# EAGLE design diagramm (EAGLE 9.5.2)
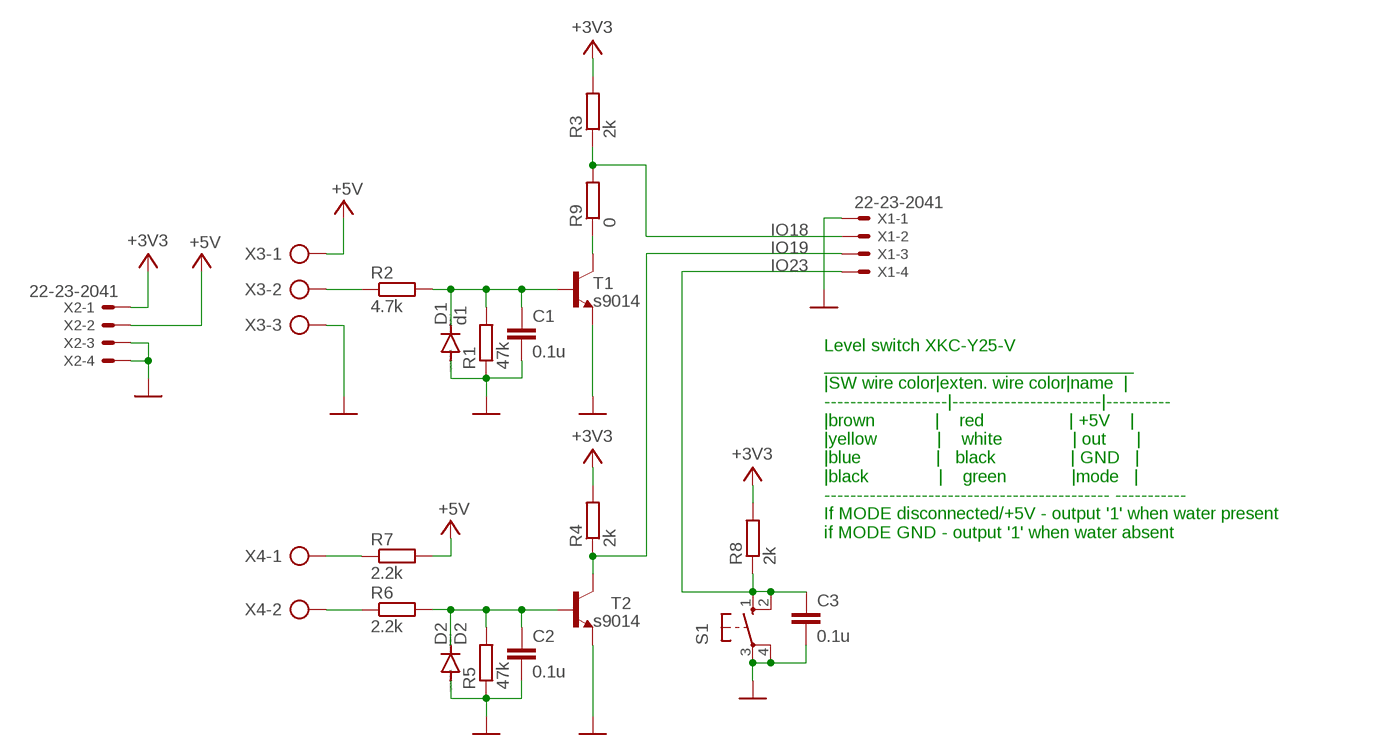
[diagram p0: schematic, sheet 1]

## Parts
C1  0.1u  C-EUC1206  [C1206]
C2  0.1u  C-EUC1206  [C1206]
C3  0.1u  C-EUC1206  [C1206]
D1  d1  DIODE-DO214AC  [DO214AC]
D2  D2  DIODE-DO214AC  [DO214AC]
R1  47k  R-EU_R1206  [R1206]
R2  4.7k  R-EU_R1206  [R1206]
R3  2k  R-EU_R1206  [R1206]
R4  2k  R-EU_R1206  [R1206]
R5  47k  R-EU_R1206  [R1206]
R6  2.2k  R-EU_R1206  [R1206]
R7  2.2k  R-EU_R1206  [R1206]
R8  2k  R-EU_R1206  [R1206]
R9  0  R-EU_R1206  [R1206]
S1  10-XX  [B3F-10XX]
T1  s9014  BC808-NPN-SOT23-BEC  [SOT23-BEC]
T2  s9014  BC808-NPN-SOT23-BEC  [SOT23-BEC]
X1  22-23-2041  [22-23-2041]
X2  22-23-2041  [22-23-2041]
X3  AK300/3  [AK300/3]
X4  AK300/2  [AK300/2]

## Nets
+3V3: R3.2 R4.2 R8.2 X2.1
+5V: R7.2 X2.2 X3.1
GND: C1.2 C2.2 C3.2 D1.A D2.A R1.1 R5.1 S1.3(P) S1.4(P1) T1.E T2.E X1.1 X2.3 X2.4 X3.3
IO18: R3.1 R9.2 X1.2
IO19: R4.1 T2.C X1.3
IO23: C3.1 R8.1 S1.1(S) S1.2(S1) X1.4
N$1: R7.1 X4.1
N$2: R2.1 X3.2
N$3: C1.1 D1.C R1.2 R2.2 T1.B
N$4: R6.1 X4.2
N$5: R9.1 T1.C
N$6: C2.1 D2.C R5.2 R6.2 T2.B

## Notes on the sheet
- Level switch XKC-Y25-V
  _______________________________
  |SW wire color|exten. wire color|name  |
  -------------------|-----------------------|----------
  |brown            |    red                 | +5V    |
  |yellow            |    white              | out      |
  |blue               |   black               | GND   |
  |black              |    green             |mode   |
  -------------------------------------------- -----------
  If MODE disconnected/+5V - output '1' when water present
  if MODE GND - output '1' when water absent

## Library data of the parts
C1-C3 = rcl:C-EU: CAPACITOR, European symbol; SPICEPREFIX: C
D1 D2 = diode:DIODE-: DIODE
R1-R9 = rcl:R-EU_: RESISTOR, European symbol; SPICEPREFIX: R
S1 = switch-omron:10-XX: OMRON SWITCH; MPN: B3F-1000; OC_FARNELL: 176432; OC_NEWARK: 36M3542
T1 T2 = transistor:*-NPN-: NPN Transistror BF959 corrected 2008.03.06
X1 X2 = con-molex:22-23-2041: .100" (2.54mm) Center Header - 4 Pin; MF: MOLEX; MPN: 22-23-2041; OC_FARNELL: 1462920; OC_NEWARK: 38C0355
X3 = con-ptr500:AK300/3: CONNECTOR; OC_FARNELL: unknown; OC_NEWARK: unknown
X4 = con-ptr500:AK300/2: CONNECTOR; OC_FARNELL: unknown; OC_NEWARK: unknown

## Board
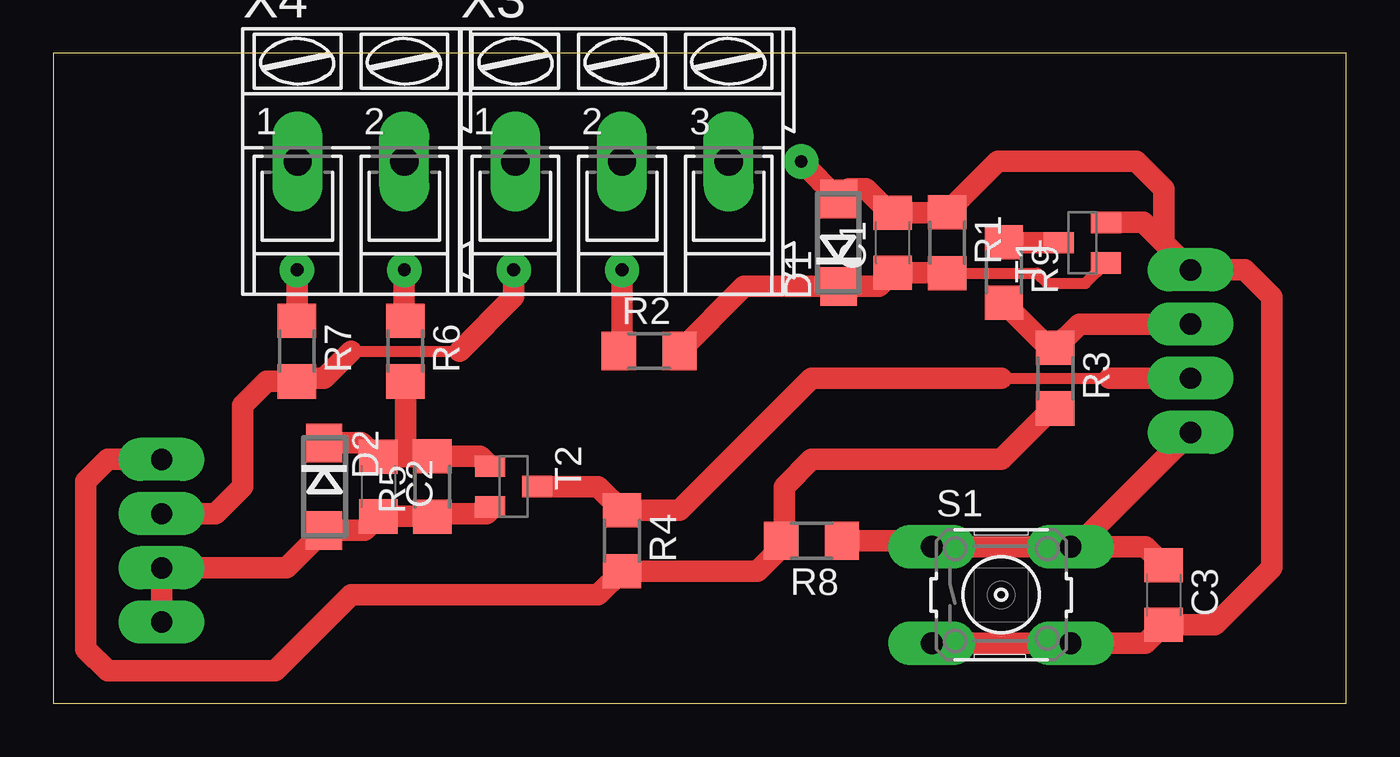
[diagram p1: board, top side]
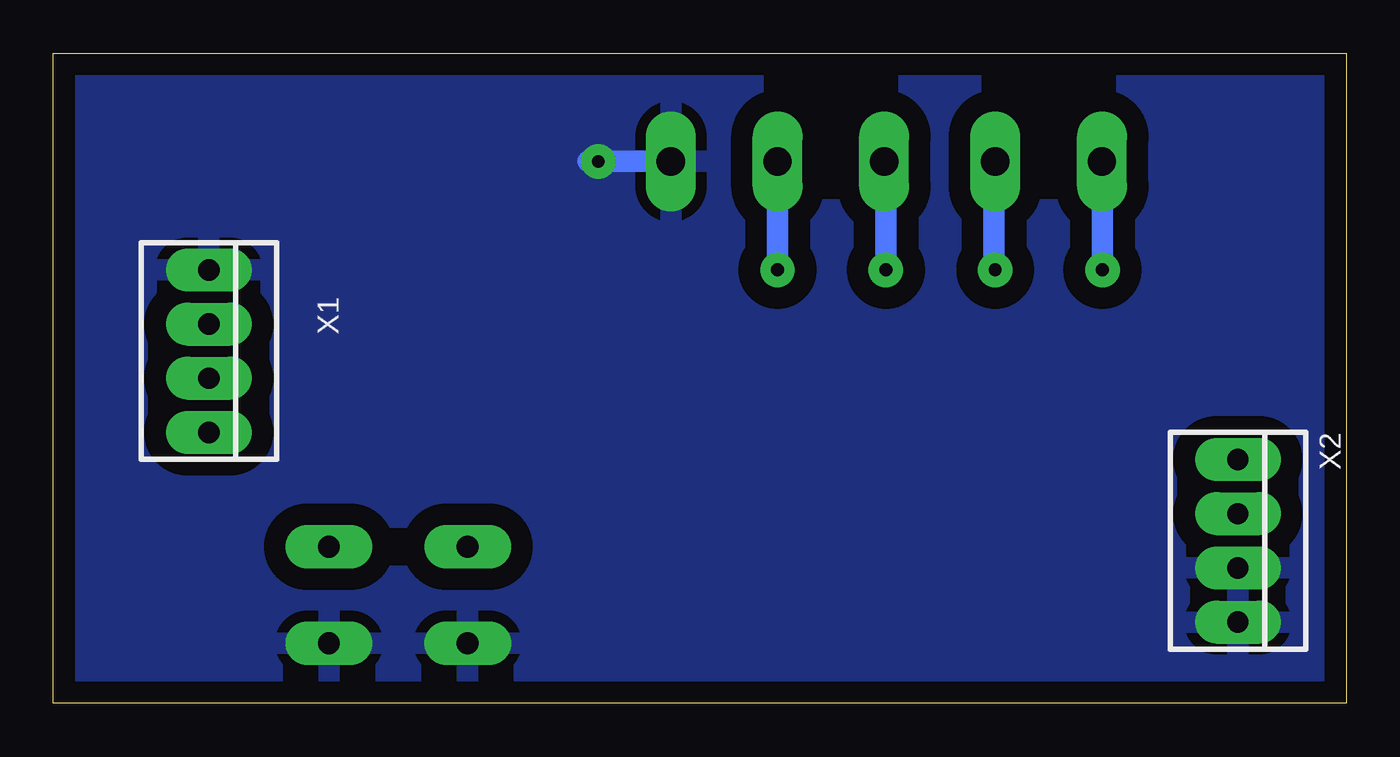
[diagram p2: board, bottom side, seen from below]

Size 60.63 x 30.47 mm. Coordinates in mm from the lower left corner, seen from the top.
Outline: 0,0 60.63,0 60.63,30.47 0,30.47 0,0
Copper layers (1*16): Top 0.035mm / dielectric 1.5mm / Bottom 0.035mm
Design rules "default": minimum track width 20mil, minimum drill 0.6mm, track to track 12mil, track to pad 12mil, pad to pad 12mil, via to via 12mil, smd to smd 12mil, copper to edge 40mil, drill to drill 40mil, minimum pad ring 20mil, minimum via ring 20mil, stop-mask expansion 4mil, vias tented up to drill 0mil, thermal gap 20mil

### Footprints (pad centres in the part's own frame; a part is rotated, then mirrored left to right if it is on the bottom)
C1206 = smd 1.6 x 1.8: 1 -1.4,0; 2 1.4,0
DO214AC = smd 1.8 x 1.7: A 2.05,0; C -2.05,0
R1206 = smd 1.6 x 1.803: 1 -1.422,0; 2 1.422,0
B3F-10XX = drill 1.016 long: 1 -3.251,2.261; 2 3.251,2.261; 3 -3.251,-2.261; 4 3.251,-2.261
SOT23-BEC = smd 1 x 1.4: B -0.95,-1.1; C 0,1.1; E 0.95,-1.1
22-23-2041 = drill 1 long: 1 -3.81,0; 2 -1.27,0; 3 1.27,0; 4 3.81,0
AK300/3 = drill 1.321 long: 1 -5.004,0; 2 0,0; 3 5.004,0
AK300/2 = drill 1.321 long: 1 -2.515,0; 2 2.489,0

### Placement (x,y rotation side)
C1  39.37,21.59 90 top
C2  15.24,10.16 270 top
C3  52.07,5.08 270 top
D1  36.83,21.59 90 top
D2  12.7,10.16 270 top
R1  41.91,21.59 270 top
R2  27.94,16.51 0 top
R3  46.99,15.24 270 top
R4  26.67,7.62 270 top
R5  17.78,10.16 90 top
R6  16.51,16.51 270 top
R7  11.43,16.51 270 top
R8  35.56,7.62 180 top
R9  44.58,20.19 270 top
S1  44.45,5.08 0 top
T1  48.26,21.59 90 top
T2  21.59,10.16 270 top
X1  53.34,16.51 270 bottom
X2  5.08,7.62 270 bottom
X3  26.67,25.4 0 top
X4  13.97,25.4 0 top

### Tracks (layer width: path | path; a pad name or v marks a point on that pad's centre or on a via)
+3V3
  Top 1.016: R3.2 46.84,13.82 44.45,11.43 35.56,11.43 34.29,10.16 34.29,7.77 R8.2 34.14,7.32 33.02,6.2 R4.2 25.55,5.08 13.97,5.08 10.41,1.52 2.54,1.52 1.52,2.54 1.52,10.41 2.54,11.43 X2.1
+5V  (via drill 0.6)
  Top 0.508: 13.97,16.51 19.05,16.51
  Top 1.016: X2.2 7.62,8.89 8.89,10.16 8.89,13.97 10.01,15.09 R7.2 11.58,15.24 12.7,15.24 13.97,16.51 | 19.05,16.51 21.59,19.05 v21.59,20.32
  Bottom 1.016: X3.1 21.59,25.32 v21.59,20.32
GND  (via drill 0.6)
  Top 1.016: X2.4 X2.3 10.94,6.35 D2.A 14.59,8.11 C2.2 17.76,8.76 R5.1 17.93,8.89 20.32,8.89 20.49,9.06 T2.E | T1.E 51.12,22.54 X1.1 | X1.1 52.07,21.59 52.07,24.13 50.8,25.4 44.3,25.4 R1.1 41.89,22.99 C1.2 39.24,22.99 38.1,24.13 37.32,24.13 D1.A v35.07,25.4 | S1.3 S1.4 51.21,2.82 C3.2 54.48,3.68 57.15,6.35 57.15,19.05 55.88,20.32 X1.1
  Bottom 1.016: X3.3 v35.07,25.4 35.56,25.4
  pour Bottom (isolate 1.016): 0,30.48 0,0 60.96,0 60.96,30.48
IO18
  Top 1.016: X1.2 48.11,17.78 R3.1 46.69,16.66 R9.2
IO19
  Top 0.508: 44.45,15.24 49.53,15.24
  Top 1.016: T2.C 25.55,10.16 R4.1 29.36,9.04 35.56,15.24 44.45,15.24 | 49.53,15.24 X1.3
IO23
  Top 1.016: S1.2 S1.1 40.92,7.62 R8.1 | S1.2 51.21,7.34 C3.1 | S1.2 47.98,7.34 X1.4
N$1  (via drill 0.6)
  Top 1.016: R7.1 v11.43,20.32
  Bottom 1.016: X4.1 11.43,25.38 v11.43,20.32
N$2  (via drill 0.6)
  Top 1.016: R2.1 26.67,16.66 26.67,19.05 v26.67,20.32
  Bottom 1.016: X3.2 v26.67,20.32
N$3
  Top 0.508: R1.2 46.13,20.17 46.61,19.68 48.41,19.68 T1.B
  Top 1.016: R2.2 32.39,19.54 D1.C 38.72,19.54 C1.1 41.89,20.19 R1.2
N$4  (via drill 0.6)
  Top 1.016: R6.1 16.46,17.98 v16.46,20.32
  Bottom 1.016: X4.2 16.51,25.35 16.51,20.32 v16.46,20.32
N$5
  Top 1.016: T1.C 44.6,21.59 R9.1
N$6
  Top 1.016: D2.C 14.46,12.21 15.24,11.43 C2.1 16.51,11.56 | 16.51,11.56 17.76,11.56 R5.2 20.02,11.58 T2.B | R6.2 16.51,11.56